# Altium project BMS.PrjPcb
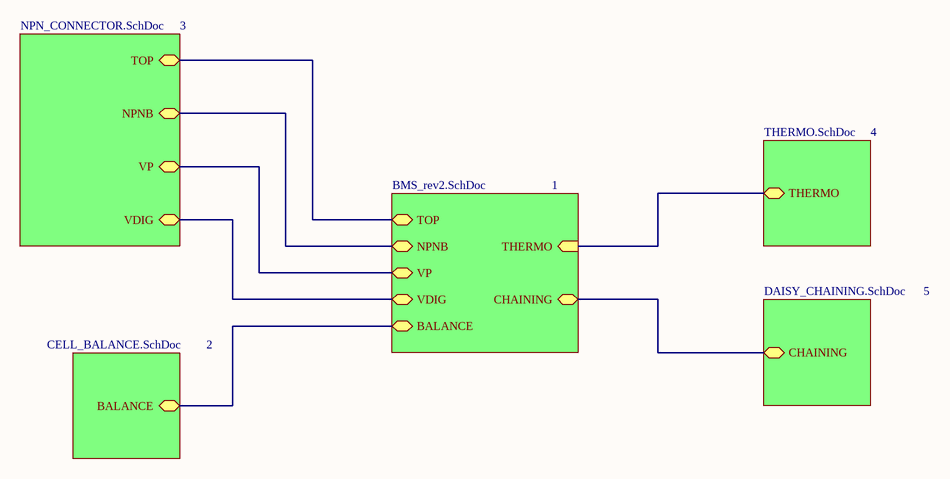
[diagram p0: BMS.SchDoc]
5 sheets, 66 parts. Net scope: hierarchical (ports join the sheet entries above them; power ports are global).
Board files: PCB_REV1.PcbDoc, PCB_REV2.PcbDoc
Sheets:
  BMS.SchDoc
    1 = BMS_rev2.SchDoc
    2 = CELL_BALANCE.SchDoc
    5 = DAISY_CHAINING.SchDoc
    4 = THERMO.SchDoc

## Sheet BMS.SchDoc
size A4

### Sub-sheets
1 = BMS_rev2.SchDoc: TOP, NPNB, VP, BALANCE, THERMO (in), CHAINING, VDIG
2 = CELL_BALANCE.SchDoc: BALANCE
3 = NPN_CONNECTOR.SchDoc (file not in this document): TOP, NPNB, VP, VDIG
4 = THERMO.SchDoc: THERMO (harness thermo)
5 = DAISY_CHAINING.SchDoc: CHAINING

### Nets
NetR67_2: sheet 1/TOP, sheet 3/TOP
NetU1_34: sheet 1/VDIG, sheet 3/VDIG
NetU1_70: sheet 1/VP, sheet 3/VP
NetU1_71: sheet 1/NPNB, sheet 3/NPNB
(unnamed): sheet 1/BALANCE, sheet 2/BALANCE
(unnamed): sheet 1/CHAINING, sheet 5/CHAINING

## Sheet BMS_rev2.SchDoc
size A4
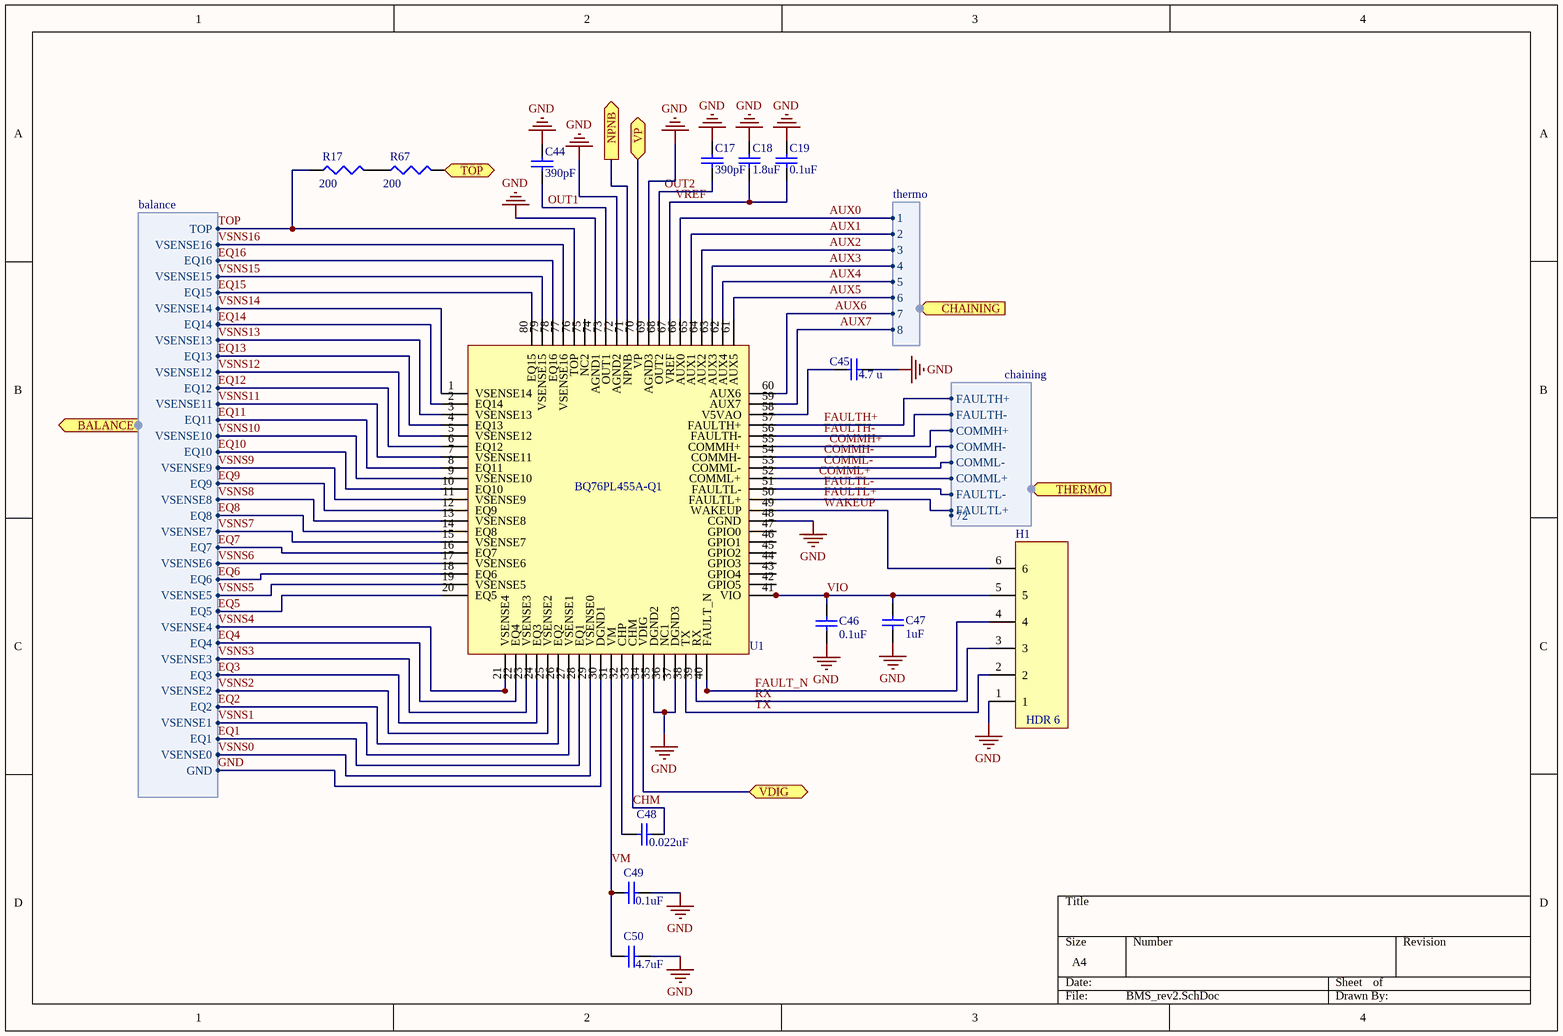
[diagram p1: BMS_rev2.SchDoc]

### Parts
C17  value 390pF  [0805 CAP]  (hidden comment: Cap Semi)
C18  value 1.8uF  [1210 cap]  (hidden comment: Cap Semi)
C19  value 0.1uF  [0603 CAP]  (hidden comment: Cap Semi)
C44  value 390pF  [0805 CAP]  (hidden comment: Cap Semi)
C45  value 4.7 u  [0805 CAP]  (hidden comment: Cap Semi)
C46  value 0.1uF  [0603 CAP]  (hidden comment: Cap Semi)
C47  value 1uF  [0603 CAP]  (hidden comment: Cap Semi)
C48  value 0.022uF  [0603 CAP]  (hidden comment: Cap Semi)
C49  value 0.1uF  [0603 CAP]  (hidden comment: Cap Semi)
C50  value 4.7uF  [0805 CAP]  (hidden comment: Cap Semi)
H1  HDR 6  [SERIAL HDR]
R17  value 200  [2512 RES]  (hidden comment: RES3)
R67  value 200  [2512 RES]  (hidden comment: RES3)
U1  BQ76PL455A-Q1  [BQ76PL455A-Q1]

### Ports
BALANCE (harness balance), CHAINING (harness thermo), NPNB, THERMO (harness chaining), TOP, VDIG, VP

### Harnesses
balance: TOP, VSENSE16, EQ16, VSENSE15, EQ15, VSENSE14, EQ14, VSENSE13, EQ13, VSENSE12, EQ12, VSENSE11, EQ11, VSENSE10, EQ10, VSENSE9, EQ9, VSENSE8, EQ8, VSENSE7, EQ7, VSENSE6, EQ6, VSENSE5, EQ5, VSENSE4, EQ4, VSENSE3, EQ3, VSENSE2, EQ2, VSENSE1, EQ1, VSENSE0, GND
chaining: FAULTH+, FAULTH-, COMMH+, COMMH-, COMML-, COMML+, FAULTL-, FAULTL+, 72
thermo: 1, 2, 3, 4, 5, 6, 7, 8

### Nets
GND: C17.1 C18.1 C19.1 C44.1 C45.2 C46.1 C47.1 C49.2 C50.2 H1.1 U1.30(DGND1) U1.35(DGND2) U1.37(DGND3) U1.48(CGND) U1.69(AGND3) U1.72(AGND2) U1.74(AGND1) ; port BALANCE.GND
AUX0: U1.66(AUX0) ; port CHAINING.1
AUX1: U1.65(AUX1) ; port CHAINING.2
AUX2: U1.64(AUX2) ; port CHAINING.3
AUX3: U1.63(AUX3) ; port CHAINING.4
AUX4: U1.62(AUX4) ; port CHAINING.5
AUX5: U1.61(AUX5) ; port CHAINING.6
AUX6: U1.60(AUX6) ; port CHAINING.7
AUX7: U1.59(AUX7) ; port CHAINING.8
CHM: C48.2 U1.33(CHM)
COMMH+: U1.55(COMMH+) ; port THERMO.COMMH+
COMMH-: U1.54(COMMH-) ; port THERMO.COMMH-
COMML+: U1.52(COMML+) ; port THERMO.COMML+
COMML-: U1.53(COMML-) ; port THERMO.COMML-
EQ1: U1.28(EQ1) ; port BALANCE.EQ1
EQ2: U1.26(EQ2) ; port BALANCE.EQ2
EQ3: U1.24(EQ3) ; port BALANCE.EQ3
EQ4: U1.22(EQ4) ; port BALANCE.EQ4
EQ5: U1.20(EQ5) ; port BALANCE.EQ5
EQ6: U1.18(EQ6) ; port BALANCE.EQ6
EQ7: U1.16(EQ7) ; port BALANCE.EQ7
EQ8: U1.14(EQ8) ; port BALANCE.EQ8
EQ9: U1.12(EQ9) ; port BALANCE.EQ9
EQ10: U1.10(EQ10) ; port BALANCE.EQ10
EQ11: U1.8(EQ11) ; port BALANCE.EQ11
EQ12: U1.6(EQ12) ; port BALANCE.EQ12
EQ13: U1.4(EQ13) ; port BALANCE.EQ13
EQ14: U1.2(EQ14) ; port BALANCE.EQ14
EQ15: U1.80(EQ15) ; port BALANCE.EQ15
EQ16: U1.78(EQ16) ; port BALANCE.EQ16
FAULT_N: H1.4 U1.40(FAULT_N)
FAULTH+: U1.57(FAULTH+) ; port THERMO.FAULTH+
FAULTH-: U1.56(FAULTH-) ; port THERMO.FAULTH-
FAULTL+: U1.50(FAULTL+) ; port THERMO.FAULTL+
FAULTL-: U1.51(FAULTL-) ; port THERMO.FAULTL-
OUT1: C44.2 U1.73(OUT1)
OUT2: C17.2 U1.68(OUT2)
RX: H1.3 U1.39(RX)
TOP: R17.1 U1.76(TOP) ; port BALANCE.TOP
TX: H1.2 U1.38(TX)
VIO: C46.2 C47.2 H1.5 U1.41(VIO)
VM: C49.1 C50.1 U1.31(VM)
VREF: C18.2 C19.2 U1.67(VREF)
VSNS0: U1.29(VSENSE0) ; port BALANCE.VSENSE0
VSNS1: U1.27(VSENSE1) ; port BALANCE.VSENSE1
VSNS2: U1.25(VSENSE2) ; port BALANCE.VSENSE2
VSNS3: U1.23(VSENSE3) ; port BALANCE.VSENSE3
VSNS4: U1.21(VSENSE4) ; port BALANCE.VSENSE4
VSNS5: U1.19(VSENSE5) ; port BALANCE.VSENSE5
VSNS6: U1.17(VSENSE6) ; port BALANCE.VSENSE6
VSNS7: U1.15(VSENSE7) ; port BALANCE.VSENSE7
VSNS8: U1.13(VSENSE8) ; port BALANCE.VSENSE8
VSNS9: U1.11(VSENSE9) ; port BALANCE.VSENSE9
VSNS10: U1.9(VSENSE10) ; port BALANCE.VSENSE10
VSNS11: U1.7(VSENSE11) ; port BALANCE.VSENSE11
VSNS12: U1.5(VSENSE12) ; port BALANCE.VSENSE12
VSNS13: U1.3(VSENSE13) ; port BALANCE.VSENSE13
VSNS14: U1.1(VSENSE14) ; port BALANCE.VSENSE14
VSNS15: U1.79(VSENSE15) ; port BALANCE.VSENSE15
VSNS16: U1.77(VSENSE16) ; port BALANCE.VSENSE16
WAKEUP: H1.6 U1.49(WAKEUP)
NetC45_1: C45.1 U1.58(V5VAO)
NetC48_1: C48.1 U1.32(CHP)
NetR17_2: R17.2 R67.1
NetR67_2: R67.2 ; port TOP
NetU1_34: U1.34(VDIG) ; port VDIG
NetU1_70: U1.70(VP) ; port VP
NetU1_71: U1.71(NPNB) ; port NPNB

Not connected (* = marked no-connect by the designer): U1 36(NC1) 42(GPIO5) 43(GPIO4) 44(GPIO3) 45(GPIO2) 46(GPIO1) 47(GPIO0) 75(NC2)

### Library data of the parts
C17 C44 = Cap Semi: Capacitor (Semiconductor SIM Model); Manufacturer: Kyocera AVX; Manufacturer Part Number: 08055A391JAT2A; Description: CAP CER 390PF 50V NP0 0805; Dielectric Material: Ceramic; Voltage Rating: 50V; Tolerance: 5%; Dielectric: C0G; Temperature Coefficient: 30ppm/°C; Published: 8-Jun-2000; LatestRevisionDate: 29-May-2009; LatestRevisionNote: IPC-7351 Footprint Added.; PackageReference: C1206; Publisher: Altium Limited; PackageDescription: Chip Capacitor; Supplier 1: Digi-Key; Supplier Part Number 1: 478-1323-1-ND; Stock 1: 18; Pricing 1: 1=0.22, 10=0.16, 100=0.075, 500=0.0526, 1000=0.0436 (USD); Mount: PCB,Surface Mount; Case/Package: 0805; Number of Pins: 2; Case Code (Imperial): 0805; Case Code (Metric): 2012; Contact Plating: Matte,Tin; Min Operating Temperature: -55°C; Max Operating Temperature: 125°C; Packaging: Tape and Reel; Capacitance: 390pF; Package Quantity: 1; Voltage Rating (DC): 50V; Termination: SMD/SMT; Voltage: 50V; Length: 2.01mm; Height: 0.94mm; Width: 1.25mm; Thickness: 0.037inch; Depth: 1.25mm; Radiation Hardening: No; REACH SVHC: No SVHC; Lead Free: Lead Free
C18 = Cap Semi: Capacitor (Semiconductor SIM Model); Manufacturer: KEMET; Manufacturer Part Number: C1210C185K3RACTU; Description: CAP CER 1.8UF 25V X7R 1210; Dielectric Material: Ceramic; Voltage Rating: 25V; Tolerance: 10%; Dielectric: X7R; Dissipation Factor: 3.5%; Published: 8-Jun-2000; LatestRevisionDate: 29-May-2009; LatestRevisionNote: IPC-7351 Footprint Added.; PackageReference: C1206; Publisher: Altium Limited; PackageDescription: Chip Capacitor; Supplier 1: Digi-Key; Supplier Part Number 1: 399-3082-1-ND; Stock 1: 3925; Pricing 1: 1=1.15, 10=0.876, 100=0.6267, 500=0.4852, 1000=0.4178 (USD); Mount: PCB,Surface Mount; Case/Package: 1210; Case Code (Metric): 3225; Case Code (Imperial): 1210; Min Operating Temperature: -55°C; Max Operating Temperature: 125°C; Package Quantity: 1; Capacitance: 1.8uF; Packaging: Tape and Reel; Voltage Rating (DC): 25V; Termination: SMD/SMT; Voltage: 25V; Length: 3.2mm; Height: 1.55mm; Width: 0.098inch; Thickness: 0.067inch; Depth: 2.5mm; REACH SVHC: No SVHC
C19 C46 C49 = Cap Semi: Capacitor (Semiconductor SIM Model); Manufacturer: KEMET; Manufacturer Part Number: C0603X104K3RACTU; Description: CAP CER 0.1UF 25V X7R 0603; Dielectric Material: Ceramic; Tolerance: 10%; Capacitance: 100nF; Voltage Rating: 25V; Dielectric: X7R; Dissipation Factor: 3.5%; Published: 8-Jun-2000; LatestRevisionDate: 29-May-2009; LatestRevisionNote: IPC-7351 Footprint Added.; PackageReference: C1206; Publisher: Altium Limited; PackageDescription: Chip Capacitor; Supplier 1: Digi-Key; Supplier Part Number 1: 399-5345-1-ND; Stock 1: 0; Pricing 1: 1=0.34, 10=0.237, 100=0.1423, 500=0.1067, 1000=0.0901 (USD); Mount: PCB,Surface Mount; Case/Package: 0603; Number of Pins: 2; Case Code (Imperial): 0603; Case Code (Metric): 1608; Contact Plating: Matte,Tin; Min Operating Temperature: -55°C; Max Operating Temperature: 125°C; Packaging: Tape and Reel; Package Quantity: 1; Voltage Rating (DC): 25V; Termination: SMD/SMT; Voltage: 25V; Features: Soft Termination; Length: 1.6mm; Height: 0.8mm; Width: 0.8mm; Thickness: 0.034inch; Depth: 0.8mm; Radiation Hardening: No; REACH SVHC: No SVHC
C45 = Cap Semi: Capacitor (Semiconductor SIM Model); Manufacturer: Murata; Manufacturer Part Number: GRM21BR71C475KA73L; Description: CAP CER 4.7UF 16V X7R 0805; Material: Ceramic; Capacitance: 4.7uF; Tolerance: 10%; Voltage Rating: 16V; Dielectric: X7R; Published: 8-Jun-2000; LatestRevisionDate: 29-May-2009; LatestRevisionNote: IPC-7351 Footprint Added.; PackageReference: C1206; Publisher: Altium Limited; PackageDescription: Chip Capacitor; Supplier 1: Digi-Key; Supplier Part Number 1: 490-4522-2-ND; Stock 1: 0; Pricing 1: 3000=0.1698 (USD); Mount: Surface Mount; Case/Package: 0805; Number of Pins: 2; Case Code (Metric): 2012; Case Code (Imperial): 0805; Min Operating Temperature: -55°C; Max Operating Temperature: 125°C; Packaging: Tape and Reel; Package Quantity: 1; Voltage Rating (DC): 16V; Termination: SMD/SMT; Voltage: 16V; Length: 2mm; Height: 1.25mm; Width: 0.049inch; Thickness: 0.053inch; Depth: 1.25mm; REACH SVHC: No SVHC; Lead Free: Lead Free
C47 = Cap Semi: Capacitor (Semiconductor SIM Model); Manufacturer: TDK; Manufacturer Part Number: C1608X7R1C105K080AC; Description: TDK   C1608X7R1C105K080AC   CAPACITOR CERAMIC, 1UF, 16V, X7R, 10%, 0603; Dielectric Material: Ceramic; Tolerance: 10%; Voltage Rating: 16V; Dielectric: X7R; Published: 8-Jun-2000; LatestRevisionDate: 29-May-2009; LatestRevisionNote: IPC-7351 Footprint Added.; PackageReference: C1206; Publisher: Altium Limited; PackageDescription: Chip Capacitor; Supplier 1: Digi-Key; Supplier Part Number 1: 445-1604-1-ND; Stock 1: 135; Pricing 1: 1=0.12, 10=0.087, 100=0.0387, 500=0.0277, 1000=0.0217 (USD); Mount: Surface Mount; Case/Package: 0603; Weight: 7.1E-05oz; Case Code (Metric): 1608; Case Code (Imperial): 0603; Min Operating Temperature: -55°C; Max Operating Temperature: 125°C; Packaging: Tape and Reel; Package Quantity: 1; Termination: SMD/SMT; Capacitance: 1uF; Voltage Rating (DC): 16V; Composition: Ceramic; Voltage: 16V; Length: 1.6mm; Height: 0.8mm; Width: 0.031inch; Thickness: 0.037inch; Depth: 0.8mm; Radiation Hardening: No; REACH SVHC: No SVHC; Lead Free: Lead Free
C48 = Cap Semi: Capacitor (Semiconductor SIM Model); Manufacturer: TDK; Manufacturer Part Number: C1608X7R1H223K080AA; Description: CAP CER 0.022UF 50V X7R 0603; Dielectric Material: Ceramic; Capacitance: 22nF; Tolerance: 10%; Voltage Rating: 50V; Dielectric: X7R; Published: 8-Jun-2000; LatestRevisionDate: 29-May-2009; LatestRevisionNote: IPC-7351 Footprint Added.; PackageReference: C1206; Publisher: Altium Limited; PackageDescription: Chip Capacitor; Supplier 1: Digi-Key; Supplier Part Number 1: 445-1312-1-ND; Stock 1: 0; Pricing 1: 1=0.1, 10=0.074, 100=0.0331, 500=0.0237, 1000=0.0186 (USD); Mount: Surface Mount; Case/Package: 0603; Number of Pins: 2; Weight: 7.1E-05oz; Case Code (Metric): 1608; Case Code (Imperial): 0603; Min Operating Temperature: -55°C; Max Operating Temperature: 125°C; Package Quantity: 1; Packaging: Tape and Reel; Voltage Rating (DC): 50V; Termination: SMD/SMT; Composition: Ceramic; Voltage: 50V; Length: 1.6mm; Height: 0.8mm; Width: 0.031inch; Thickness: 0.037inch; Depth: 0.8mm; Radiation Hardening: No; REACH SVHC: No SVHC; Lead Free: Lead Free
C50 = Cap Semi: Capacitor (Semiconductor SIM Model); Manufacturer: Murata; Manufacturer Part Number: GRM21BR71C475KA73L; Description: CAP CER 4.7UF 16V X7R 0805; Material: Ceramic; Tolerance: 10%; Voltage Rating: 16V; Dielectric: X7R; Published: 8-Jun-2000; LatestRevisionDate: 29-May-2009; LatestRevisionNote: IPC-7351 Footprint Added.; PackageReference: C1206; Publisher: Altium Limited; PackageDescription: Chip Capacitor; Supplier 1: Digi-Key; Supplier Part Number 1: 490-4522-2-ND; Stock 1: 0; Pricing 1: 3000=0.1698 (USD); Mount: Surface Mount; Case/Package: 0805; Number of Pins: 2; Case Code (Metric): 2012; Case Code (Imperial): 0805; Min Operating Temperature: -55°C; Max Operating Temperature: 125°C; Capacitance: 4.7uF; Packaging: Tape and Reel; Package Quantity: 1; Voltage Rating (DC): 16V; Termination: SMD/SMT; Voltage: 16V; Length: 2mm; Height: 1.25mm; Width: 0.049inch; Thickness: 0.053inch; Depth: 1.25mm; REACH SVHC: No SVHC; Lead Free: Lead Free
H1 = HDR 6: Manufacturer: Molex; Manufacturer Part Number: 0022124062; Contact Resistance: 10mR; Number of Positions: 6; Gender: Male; Connector Type: Male Pin; Pitch: 2.54mm; Supplier 1: Digi-Key; Supplier Part Number 1: WM13446-ND; Stock 1: 3075; Pricing 1: 1=1.06, 10=0.934, 100=0.8059, 500=0.6593, 1000=0.5861, 5000=0.5128, 10000=0.4872 (USD); Mount: Through Hole; Contact Plating: Gold; Contact Material: Brass; Colour: Natural; Housing Material: Nylon; Housing Colour: Natural; Min Operating Temperature: 0°C; Max Operating Temperature: 75°C; Package Quantity: 1000; Number of Rows: 1; Packaging: Bulk; Termination: Solder; Number of Contacts: 6; Orientation: Right Angle; Fastening Type: Friction; Length: 15.24mm; Contact Mating Length: 0.264inch; Depth: 14.42mm
R17 R67 = RES3: Resistor; Manufacturer: Vishay Dale; Manufacturer Part Number: CRCW2512200RJNEG; Description: RES SMD 200 OHM 5% 1W 2512; Resistance: 200R; Tolerance: 5%; Power Rating: 1W; Voltage Rating: 500V; Temperature Coefficient: 200ppm/°C; Published: 8-Jun-2000; LatestRevisionDate: 29-May-2009; LatestRevisionNote: IPC-7351 Footprint Added.; PackageReference: J1-0603; Publisher: Altium Limited; PackageDescription: Chip Resistor; Supplier 1: Digi-Key; Supplier Part Number 1: 541-200XCT-ND; Stock 1: 1091; Pricing 1: 1=0.39, 10=0.333, 100=0.1301, 1000=0.0545 (USD); Mount: Surface Mount; Case/Package: 2512; Number of Pins: 2; Weight: 0.001429oz; Case Code (Metric): 6432; Case Code (Imperial): 2512; Contact Plating: Tin; Min Operating Temperature: -55°C; Max Operating Temperature: 155°C; Packaging: Tape and Reel; Package Quantity: 2000; Composition: Thick Film; Number of Terminations: 2; Termination: SMD/SMT; Military Standard: Not; Max Power Dissipation: 1W; Voltage Rating (DC): 500V; Working Voltage: 500V; Features: Automotive AEC-Q200; Length: 6.3mm; Height: 0.6mm; Width: 0.124inch; Depth: 3.15mm; Radiation Hardening: No; REACH SVHC: Unknown; Lead Free: Lead Free
U1 = BQ76PL455A-Q1: Manufacturer: Texas Instruments; Manufacturer Part Number: BQ76PL455ATPFCRQ1; Interface: UART; Fault Protection: Over/Under Voltage; Operating Supply Voltage: 22V; Supplier 1: Digi-Key; Stock 1: 0; Pricing 1: 1=19.03, 10=17.486, 100=14.7676, 500=13.1368 (USD); Mount: Surface Mount; Case/Package: TQFP; Number of Pins: 80; Min Operating Temperature: -40°C; Max Operating Temperature: 105°C; Packaging: Tape and Reel; Lead Free: Lead Free; Supplier Part Number 1: 296-44049-1-ND

## Sheet CELL_BALANCE.SchDoc
size A4
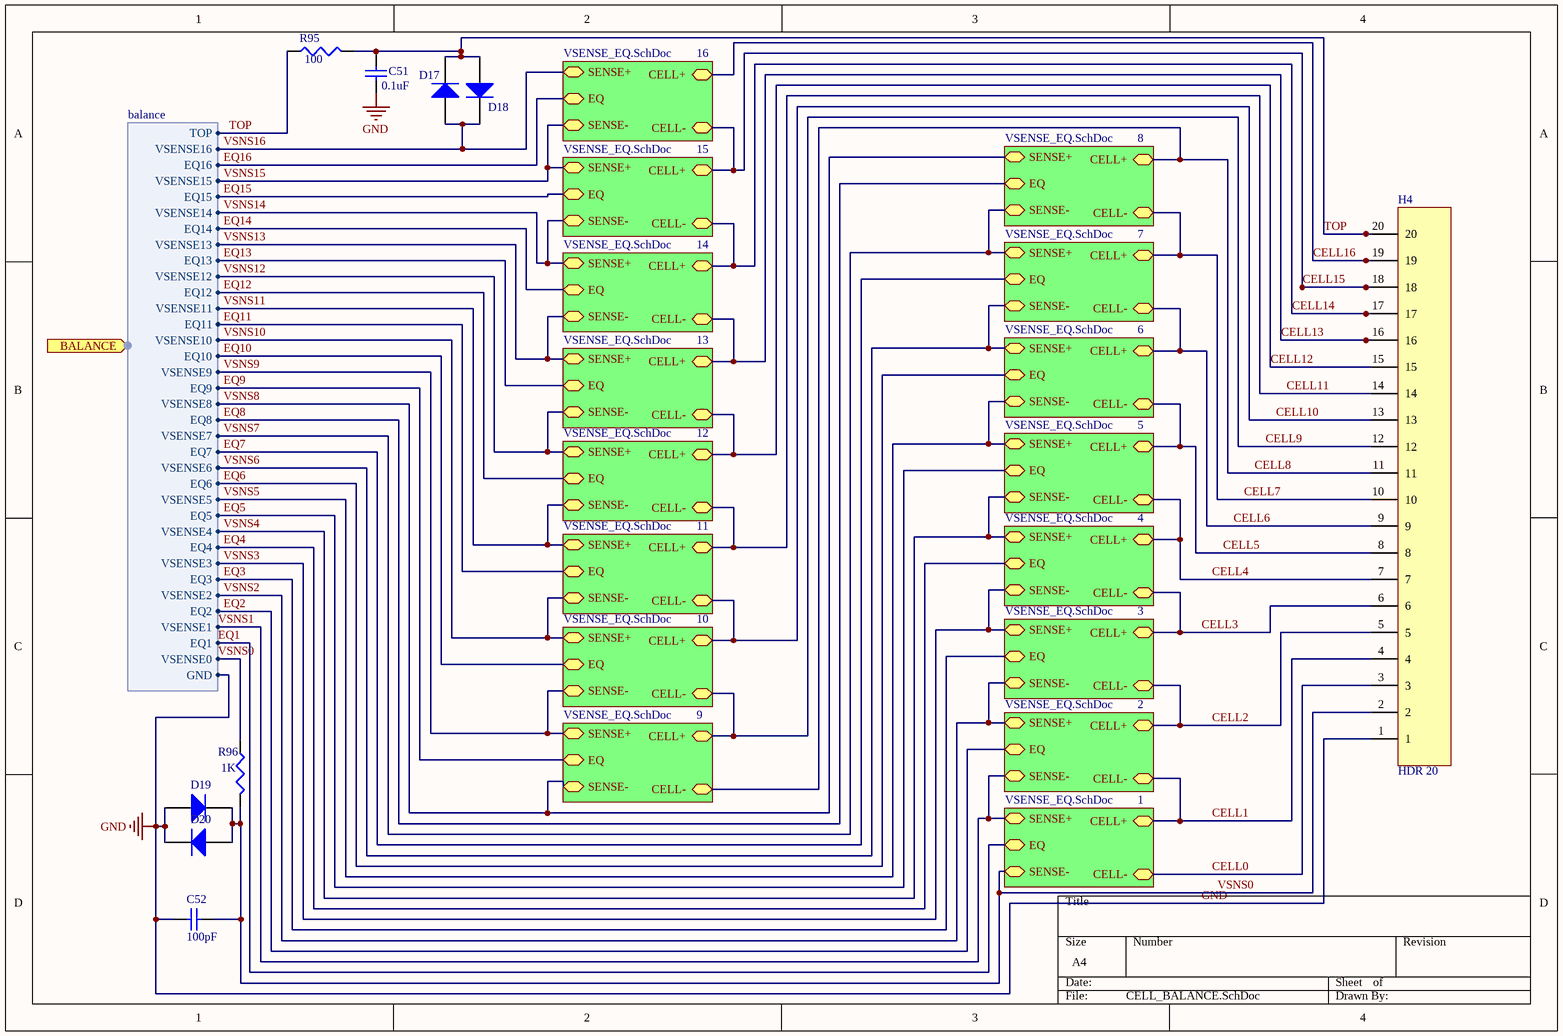
[diagram p2: CELL_BALANCE.SchDoc]

### Parts
C51  value 0.1uF  [1210 cap]  (hidden comment: Cap Semi)
C52  value 100pF  [0603 CAP]  (hidden comment: Cap Semi)
D17  (no value)  [DIODE BtoB]
D18  (no value)  [DIODE BtoB]
D19  (no value)  [DIODE BtoB]
D20  (no value)  [DIODE BtoB]
H4  HDR 20  [CELL HDR]
R95  value 100  [1206 RES]  (hidden comment: Res3)
R96  value 1K  [0603 RES]  (hidden comment: Res3)

### Sub-sheets
1 = VSENSE_EQ.SchDoc (file not in this document): SENSE+, CELL+, SENSE-, CELL-, EQ
2 = VSENSE_EQ.SchDoc (file not in this document): SENSE+, CELL+, SENSE-, CELL-, EQ
3 = VSENSE_EQ.SchDoc (file not in this document): SENSE+, CELL+, SENSE-, CELL-, EQ
4 = VSENSE_EQ.SchDoc (file not in this document): SENSE+, CELL+, SENSE-, CELL-, EQ
5 = VSENSE_EQ.SchDoc (file not in this document): SENSE+, CELL+, SENSE-, CELL-, EQ
6 = VSENSE_EQ.SchDoc (file not in this document): SENSE+, CELL+, SENSE-, CELL-, EQ
7 = VSENSE_EQ.SchDoc (file not in this document): SENSE+, CELL+, SENSE-, CELL-, EQ
8 = VSENSE_EQ.SchDoc (file not in this document): SENSE+, CELL+, SENSE-, CELL-, EQ
9 = VSENSE_EQ.SchDoc (file not in this document): SENSE+, CELL+, SENSE-, CELL-, EQ
10 = VSENSE_EQ.SchDoc (file not in this document): SENSE+, CELL+, SENSE-, CELL-, EQ
11 = VSENSE_EQ.SchDoc (file not in this document): SENSE+, CELL+, SENSE-, CELL-, EQ
12 = VSENSE_EQ.SchDoc (file not in this document): SENSE+, CELL+, SENSE-, CELL-, EQ
13 = VSENSE_EQ.SchDoc (file not in this document): SENSE+, CELL+, SENSE-, CELL-, EQ
14 = VSENSE_EQ.SchDoc (file not in this document): SENSE+, CELL+, SENSE-, CELL-, EQ
15 = VSENSE_EQ.SchDoc (file not in this document): SENSE+, CELL+, SENSE-, CELL-, EQ
16 = VSENSE_EQ.SchDoc (file not in this document): SENSE+, CELL+, SENSE-, CELL-, EQ

### Ports
BALANCE (harness balance)

### Harnesses
balance: GND, VSENSE0, EQ1, VSENSE1, EQ2, VSENSE2, EQ3, VSENSE3, EQ4, VSENSE4, EQ5, VSENSE5, EQ6, VSENSE6, EQ7, VSENSE7, EQ8, VSENSE8, EQ9, VSENSE9, EQ10, VSENSE10, EQ11, VSENSE11, EQ12, VSENSE12, EQ13, VSENSE13, EQ14, VSENSE14, EQ15, VSENSE15, EQ16, VSENSE16, TOP

### Nets
GND: C51.1 C52.1 D19.1(A) D20.2(K) H4.1 ; port BALANCE.GND
CELL0: H4.3 ; sheet 1/CELL-
CELL1: H4.4 ; sheet 2/CELL-, sheet 1/CELL+
CELL2: H4.5 ; sheet 3/CELL-, sheet 2/CELL+
CELL3: H4.6 ; sheet 4/CELL-, sheet 3/CELL+
CELL4: H4.7 ; sheet 4/CELL+, sheet 5/CELL-
CELL5: H4.8 ; sheet 5/CELL+, sheet 6/CELL-
CELL6: H4.9 ; sheet 6/CELL+, sheet 7/CELL-
CELL7: H4.10 ; sheet 7/CELL+, sheet 8/CELL-
CELL8: H4.11 ; sheet 8/CELL+, sheet 9/CELL-
CELL9: H4.12 ; sheet 10/CELL-, sheet 9/CELL+
CELL10: H4.13 ; sheet 11/CELL-, sheet 10/CELL+
CELL11: H4.14 ; sheet 12/CELL-, sheet 11/CELL+
CELL12: H4.15 ; sheet 12/CELL+, sheet 13/CELL-
CELL13: H4.16 ; sheet 13/CELL+, sheet 14/CELL-
CELL14: H4.17 ; sheet 14/CELL+, sheet 15/CELL-
CELL15: H4.18 ; sheet 15/CELL+, sheet 16/CELL-
CELL16: H4.19 ; sheet 16/CELL+
EQ1: sheet 1/EQ, port BALANCE.EQ1
EQ2: sheet 2/EQ, port BALANCE.EQ2
EQ3: sheet 3/EQ, port BALANCE.EQ3
EQ4: sheet 4/EQ, port BALANCE.EQ4
EQ5: sheet 5/EQ, port BALANCE.EQ5
EQ6: sheet 6/EQ, port BALANCE.EQ6
EQ7: sheet 7/EQ, port BALANCE.EQ7
EQ8: sheet 8/EQ, port BALANCE.EQ8
EQ9: sheet 9/EQ, port BALANCE.EQ9
EQ10: sheet 10/EQ, port BALANCE.EQ10
EQ11: sheet 11/EQ, port BALANCE.EQ11
EQ12: sheet 12/EQ, port BALANCE.EQ12
EQ13: sheet 13/EQ, port BALANCE.EQ13
EQ14: sheet 14/EQ, port BALANCE.EQ14
EQ15: sheet 15/EQ, port BALANCE.EQ15
EQ16: sheet 16/EQ, port BALANCE.EQ16
TOP: C51.2 D17.2(K) D18.1(A) H4.20 R95.1 R95.2 ; port BALANCE.TOP
VSNS0: C52.2 D19.2(K) D20.1(A) H4.2 R96.1 R96.2 ; sheet 1/SENSE-, port BALANCE.VSENSE0
VSNS1: sheet 2/SENSE-, sheet 1/SENSE+, port BALANCE.VSENSE1
VSNS2: sheet 3/SENSE-, sheet 2/SENSE+, port BALANCE.VSENSE2
VSNS3: sheet 4/SENSE-, sheet 3/SENSE+, port BALANCE.VSENSE3
VSNS4: sheet 4/SENSE+, sheet 5/SENSE-, port BALANCE.VSENSE4
VSNS5: sheet 5/SENSE+, sheet 6/SENSE-, port BALANCE.VSENSE5
VSNS6: sheet 6/SENSE+, sheet 7/SENSE-, port BALANCE.VSENSE6
VSNS7: sheet 7/SENSE+, sheet 8/SENSE-, port BALANCE.VSENSE7
VSNS8: sheet 8/SENSE+, sheet 9/SENSE-, port BALANCE.VSENSE8
VSNS9: sheet 10/SENSE-, sheet 9/SENSE+, port BALANCE.VSENSE9
VSNS10: sheet 11/SENSE-, sheet 10/SENSE+, port BALANCE.VSENSE10
VSNS11: sheet 12/SENSE-, sheet 11/SENSE+, port BALANCE.VSENSE11
VSNS12: sheet 12/SENSE+, sheet 13/SENSE-, port BALANCE.VSENSE12
VSNS13: sheet 13/SENSE+, sheet 14/SENSE-, port BALANCE.VSENSE13
VSNS14: sheet 14/SENSE+, sheet 15/SENSE-, port BALANCE.VSENSE14
VSNS15: sheet 15/SENSE+, sheet 16/SENSE-, port BALANCE.VSENSE15
VSNS16: D17.1(A) D18.2(K) ; sheet 16/SENSE+, port BALANCE.VSENSE16

### Library data of the parts
C51 = Cap Semi: Capacitor (Semiconductor SIM Model); Manufacturer: Murata; Manufacturer Part Number: GRM32NR72A104KA01L; Description: CAP CER 0.1UF 100V X7R 1210; Material: Ceramic; Capacitance: 100nF; Tolerance: 10%; Voltage Rating: 100V; Dielectric: X7R; Dissipation Factor: 0.05%; Published: 8-Jun-2000; LatestRevisionDate: 29-May-2009; LatestRevisionNote: IPC-7351 Footprint Added.; PackageReference: C1206; Publisher: Altium Limited; PackageDescription: Chip Capacitor; Supplier 1: Digi-Key; Supplier Part Number 1: 490-1853-1-ND; Stock 1: 0; Pricing 1: 1=0.86, 10=0.608, 100=0.4002, 500=0.2964, 1000=0.252 (USD); Mount: Surface Mount; Case/Package: 1210; Weight: 0.00388oz; Case Code (Metric): 3225; Case Code (Imperial): 1210; Dielectric Material: Ceramic; Min Operating Temperature: -55°C; Max Operating Temperature: 125°C; Package Quantity: 1; Packaging: Tape and Reel; Voltage Rating (DC): 100V; Termination: SMD/SMT; Voltage: 100V; Length: 3.2mm; Height: 1.35mm; Width: 2.5mm; Thickness: 0.059inch; Depth: 2.5mm; Radiation Hardening: No; Lead Free: Lead Free
C52 = Cap Semi: Capacitor (Semiconductor SIM Model); Manufacturer: TDK; Manufacturer Part Number: C1608X7R1C105K080AC; Description: TDK   C1608X7R1C105K080AC   CAPACITOR CERAMIC, 1UF, 16V, X7R, 10%, 0603; Dielectric Material: Ceramic; Tolerance: 10%; Capacitance: 1uF; Voltage Rating: 16V; Dielectric: X7R; Published: 8-Jun-2000; LatestRevisionDate: 29-May-2009; LatestRevisionNote: IPC-7351 Footprint Added.; PackageReference: C1206; Publisher: Altium Limited; PackageDescription: Chip Capacitor; Supplier 1: Digi-Key; Supplier Part Number 1: 445-1604-6-ND; Stock 1: 8000; Pricing 1: 1=0.12, 10=0.087, 100=0.0387, 500=0.0277, 1000=0.0217 (USD); Mount: Surface Mount; Case/Package: 0603; Weight: 7.1E-05oz; Case Code (Metric): 1608; Case Code (Imperial): 0603; Min Operating Temperature: -55°C; Max Operating Temperature: 125°C; Packaging: Tape and Reel; Package Quantity: 1; Termination: SMD/SMT; Voltage Rating (DC): 16V; Composition: Ceramic; Voltage: 16V; Length: 1.6mm; Height: 0.8mm; Width: 0.031inch; Thickness: 0.037inch; Depth: 0.8mm; Radiation Hardening: No; REACH SVHC: No SVHC; Lead Free: Lead Free
D17-D20 = Diode: Default Diode; Manufacturer: Diodes; Manufacturer Part Number: 1N4148W-7-F; Description: DIODE GEN PURP 100V 300MA SOD123; Max Surge Current: 2A; Forward Current: 150mA; Peak Reverse Current: 1uA; Recovery Time: 4ns; Forward Voltage: 1.25V; Average Rectified Current: 300mA; Max Repetitive Reverse Voltage (Vrrm): 100V; Power Dissipation: 400mW; Element Configuration: Single; Polarity: Standard; Voltage Rating (DC): 75V; Capacitance: 2pF; Current: 15A; Published: 8-Jun-2000; LatestRevisionDate: 17-Jul-2002; LatestRevisionNote: Re-released for DXP Platform.; PackageVersion: Sep-1996; PackageReference: SMC; Publisher: Altium Limited; PackageDescription: DO-214-AB/SMC; 2 C-Bend Leads; Body 7.9 x 5.9 mm, inc. leads (LxW); Code_JEDEC: DO-214-AB; Supplier 1: Digi-Key; Supplier Part Number 1: 1N4148W-FDICT-ND; Stock 1: 0; Pricing 1: 1=0.18, 10=0.164, 100=0.0891, 500=0.0548, 1000=0.0374 (USD); Mount: Surface Mount; Number of Pins: 2; Weight: 0.000353oz; Contact Plating: Matte,Tin; Min Operating Temperature: -65°C; Max Operating Temperature: 150°C; Package Quantity: 3000; Packaging: Tape and Reel; Reverse Recovery Time: 4ns; Peak Non-Repetitive Surge Current: 2A; Power Rating: 400mW; Max Reverse Voltage (DC): 100V; Max Forward Surge Current (Ifsm): 2A; Current Rating: 150mA; Output Current: 150mA; Voltage: 100V; Length: 2.85mm; Height: 1.25mm; Width: 1.7mm; Radiation Hardening: No; Lead Free: Lead Free; REACH SVHC: No SVHC
R95 = Res3: Resistor; Manufacturer: Vishay Dale; Manufacturer Part Number: CRCW1206100RFKEA; Description: Res Thick Film 1206 100 Ohm 1% 0.25W(1/4W) ±100ppm/C SMD Automotive Paper T/R; Resistance: 100R; Tolerance: 1%; Power Rating: 250mW; Voltage Rating: 200V; Temperature Coefficient: 100ppm/°C; Published: 8-Jun-2000; LatestRevisionDate: 29-May-2009; LatestRevisionNote: IPC-7351 Footprint Added.; PackageReference: J1-0603; Publisher: Altium Limited; PackageDescription: Chip Resistor; Supplier 1: Digi-Key; Supplier Part Number 1: 541-100FCT-ND; Stock 1: 0; Pricing 1: 1=0.1, 10=0.075, 100=0.0304, 1000=0.0136, 2500=0.0118 (USD); Mount: Surface Mount; Case/Package: 1206; Number of Pins: 2; Weight: 0.000353oz; Case Code (Imperial): 1206; Case Code (Metric): 3216; Contact Plating: Tin; Min Operating Temperature: -55°C; Max Operating Temperature: 155°C; Packaging: Tape and Reel; Package Quantity: 5000; Composition: Thick Film; Termination: SMD/SMT; Military Standard: Not; Voltage Rating (DC): 200V; Length: 3.2mm; Height: 0.55mm; Width: 1.6mm; Depth: 1.6mm; Radiation Hardening: No; REACH SVHC: Unknown; Lead Free: Lead Free
R96 = Res3: Resistor; Manufacturer: Vishay Dale; Manufacturer Part Number: CRCW06031K00FKEA; Description: RES SMD 1K OHM 1% 1/10W 0603; Resistance: 1kR; Power Rating: 100mW; Tolerance: 1%; Voltage Rating: 75V; Temperature Coefficient: 100ppm/°C; Published: 8-Jun-2000; LatestRevisionDate: 29-May-2009; LatestRevisionNote: IPC-7351 Footprint Added.; PackageReference: J1-0603; Publisher: Altium Limited; PackageDescription: Chip Resistor; Supplier 1: Digi-Key; Supplier Part Number 1: 541-1.00KHCT-ND; Stock 1: 0; Pricing 1: 1=0.1, 10=0.042, 100=0.017, 1000=0.0076, 2500=0.0066 (USD); Mount: Surface Mount; Case/Package: 0603; Number of Pins: 2; Weight: 7.1E-05oz; Case Code (Metric): 1608; Case Code (Imperial): 0603; Contact Plating: Tin; Min Operating Temperature: -55°C; Max Operating Temperature: 155°C; Composition: Thick Film; Packaging: Tape and Reel; Package Quantity: 10; Number of Terminations: 2; Termination: SMD/SMT; Military Standard: Not; Max Power Dissipation: 100mW; Voltage Rating (DC): 75V; Features: Automotive AEC-Q200; Length: 1.55mm; Height: 0.45mm; Width: 0.033inch; Depth: 0.85mm; Radiation Hardening: No; REACH SVHC: Unknown; Lead Free: Lead Free

## Sheet DAISY_CHAINING.SchDoc
size A4
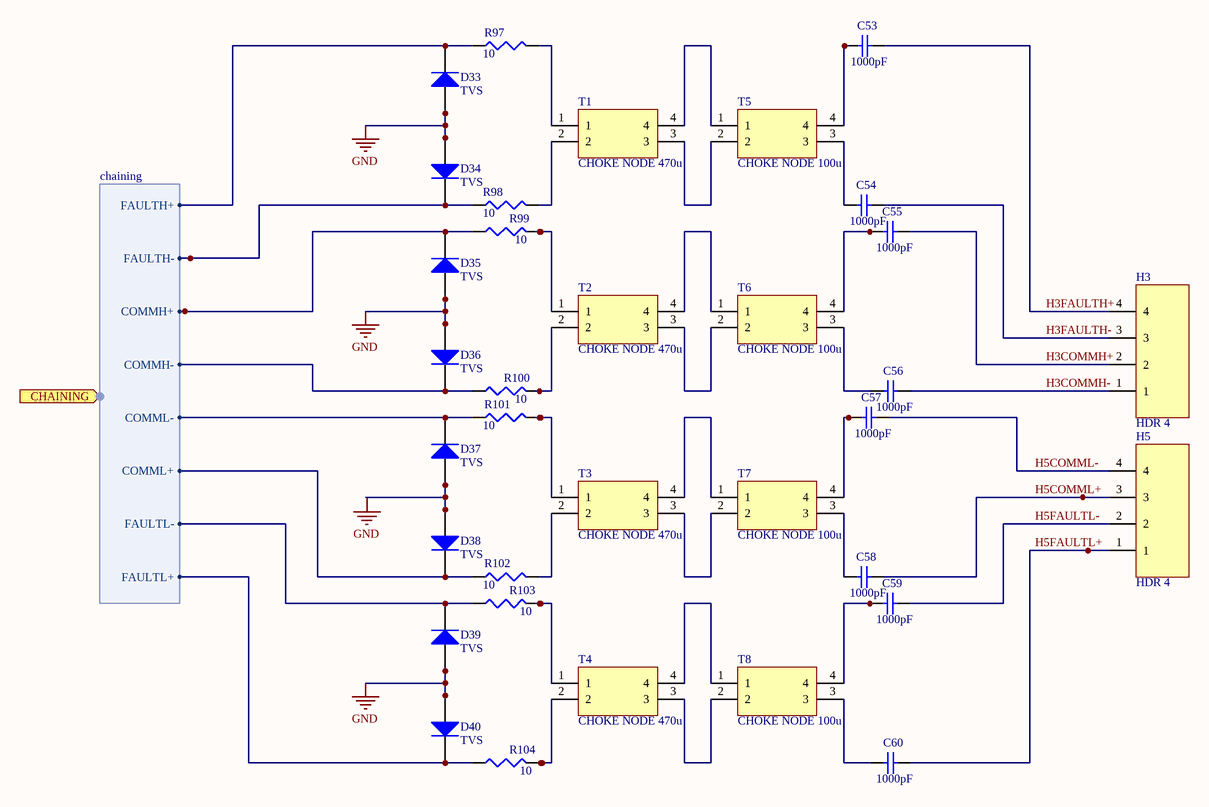
[diagram p3: DAISY_CHAINING.SchDoc]

### Parts
C53  value 1000pF  [1206 CAP]  (hidden comment: Cap Semi)
C54  value 1000pF  [1206 CAP]  (hidden comment: Cap Semi)
C55  value 1000pF  [1206 CAP]  (hidden comment: Cap Semi)
C56  value 1000pF  [1206 CAP]  (hidden comment: Cap Semi)
C57  value 1000pF  [1206 CAP]  (hidden comment: Cap Semi)
C58  value 1000pF  [1206 CAP]  (hidden comment: Cap Semi)
C59  value 1000pF  [1206 CAP]  (hidden comment: Cap Semi)
C60  value 1000pF  [1206 CAP]  (hidden comment: Cap Semi)
D33  TVS  [TVS DIODE]
D34  TVS  [TVS DIODE]
D35  TVS  [TVS DIODE]
D36  TVS  [TVS DIODE]
D37  TVS  [TVS DIODE]
D38  TVS  [TVS DIODE]
D39  TVS  [TVS DIODE]
D40  TVS  [TVS DIODE]
H3  HDR 4  [COMM HDR]
H5  HDR 4  [COMM HDR]
R97  value 10  [1206 RES]  (hidden comment: Res3)
R98  value 10  [1206 RES]  (hidden comment: Res3)
R99  value 10  [1206 RES]  (hidden comment: Res3)
R100  value 10  [1206 RES]  (hidden comment: Res3)
R101  value 10  [1206 RES]  (hidden comment: Res3)
R102  value 10  [1206 RES]  (hidden comment: Res3)
R103  value 10  [1206 RES]  (hidden comment: Res3)
R104  value 10  [1206 RES]  (hidden comment: Res3)
T1  CHOKE NODE 470u  [CHOKE NODE 470u]
T2  CHOKE NODE 470u  [CHOKE NODE 470u]
T3  CHOKE NODE 470u  [CHOKE NODE 470u]
T4  CHOKE NODE 470u  [CHOKE NODE 470u]
T5  CHOKE NODE 100u  [CHOKE NODE 100u]
T6  CHOKE NODE 100u  [CHOKE NODE 100u]
T7  CHOKE NODE 100u  [CHOKE NODE 100u]
T8  CHOKE NODE 100u  [CHOKE NODE 100u]

### Ports
CHAINING (harness chaining)

### Harnesses
chaining: FAULTH+, FAULTH-, COMMH+, COMMH-, COMML+, COMML-, FAULTL-, FAULTL+

### Nets
GND: D33.1(A) D34.1(A) D35.1(A) D36.1(A) D39.1(A) D40.1(A)
H3COMMH+: C55.2 H3.2
H3COMMH-: C56.2 H3.1
H3FAULTH+: C53.2 H3.4
H3FAULTH-: C54.2 H3.3
H5COMML+: C58.2 H5.3
H5COMML-: C57.2 H5.4
H5FAULTL+: C60.2 H5.1
H5FAULTL-: C59.2 H5.2
NetC53_1: C53.1 T5.4
NetC54_1: C54.1 T5.3
NetC55_1: C55.1 T6.4
NetC56_1: C56.1 T6.3
NetC57_1: C57.1 T7.4
NetC58_1: C58.1 T7.3
NetC59_1: C59.1 T8.4
NetC60_1: C60.1 T8.3
NetD33_2: D33.2(K) R97.1
NetD34_2: D34.2(K) R98.1
NetD35_2: D35.2(K) R99.1
NetD36_2: D36.2(K) R100.1
NetD37_1: D37.1(A) D38.1(A)
NetD37_2: D37.2(K) R101.1
NetD38_2: D38.2(K) R102.1
NetD39_2: D39.2(K) R103.1
NetD40_2: D40.2(K) R104.1
NetR97_2: R97.2 T1.1
NetR98_2: R98.2 T1.2
NetR99_2: R99.2 T2.1
NetR100_2: R100.2 T2.2
NetR101_2: R101.2 T3.1
NetR102_2: R102.2 T3.2
NetR103_2: R103.2 T4.1
NetR104_2: R104.2 T4.2
NetT1_3: T1.3 T5.2
NetT1_4: T1.4 T5.1
NetT2_3: T2.3 T6.2
NetT2_4: T2.4 T6.1
NetT3_3: T3.3 T7.2
NetT3_4: T3.4 T7.1
NetT4_3: T4.3 T8.2
NetT4_4: T4.4 T8.1

### Notes on the sheet
- Labels drawn without touching a wire or pin: GND

### Library data of the parts
C53-C60 = Cap Semi: Capacitor (Semiconductor SIM Model); Manufacturer: Yageo; Manufacturer Part Number: CC1206KKX7RCBB102; Description: CAP CER 1000PF 1KV X7R 1206; Dielectric Material: Ceramic; Capacitance: 1nF; Voltage Rating (DC): 1kV; Tolerance: 10%; Dielectric: X7R; Published: 8-Jun-2000; LatestRevisionDate: 29-May-2009; LatestRevisionNote: IPC-7351 Footprint Added.; PackageReference: C1206; Publisher: Altium Limited; PackageDescription: Chip Capacitor; Supplier 1: Digi-Key; Supplier Part Number 1: 311-1144-1-ND; Stock 1: 12559; Pricing 1: 1=0.44, 10=0.304, 100=0.1821, 500=0.1366, 1000=0.1154 (USD); Mount: Surface Mount; Case/Package: 1206; Number of Pins: 2; Weight: 0.000571oz; Case Code (Imperial): 1206; Case Code (Metric): 3216; Min Operating Temperature: -55°C; Max Operating Temperature: 125°C; Packaging: Tape and Reel; Package Quantity: 1; Voltage Rating: 1kV; Termination: SMD/SMT; Composition: Ceramic; Length: 3.2mm; Height: 1.15mm; Width: 1.6mm; Thickness: 0.045inch; Depth: 1.6mm; Radiation Hardening: No; REACH SVHC: No SVHC; Lead Free: Lead Free
D33-D40 = DIODE: Default Diode; Manufacturer: NXP Semiconductors; Manufacturer Part Number: PESD5V0U1UA,115; Description: TVS DIODE 5VWM SOD3232; Direction: Unidirectional; Capacitance: 2.6pF; Number of Channels: 1; Operating Supply Voltage: 5V; Min Breakdown Voltage: 5.8V; Power Line Protection: No; Leakage Current: 100nA; Max Breakdown Voltage: 8.8V; Element Configuration: Single; Published: 8-Jun-2000; LatestRevisionDate: 17-Jul-2002; LatestRevisionNote: Re-released for DXP Platform.; PackageVersion: Sep-1996; PackageReference: SMC; Publisher: Altium Limited; PackageDescription: DO-214-AB/SMC; 2 C-Bend Leads; Body 7.9 x 5.9 mm, inc. leads (LxW); Code_JEDEC: DO-214-AB; Supplier 1: Digi-Key; Supplier Part Number 1: 1727-4155-1-ND; Stock 1: 107363; Pricing 1: 1=0.48, 10=0.36, 100=0.2243, 500=0.1535, 1000=0.1181 (USD); Mount: Surface Mount; Number of Pins: 2; Min Operating Temperature: -55°C; Max Operating Temperature: 150°C; Packaging: Tape and Reel; Package Quantity: 1; Number of Unidirectional Channels: 1; Reverse Standoff Voltage: 5V; Polarity: Unidirectional; Breakdown Voltage: 5.8V; Termination: SMD/SMT; Working Voltage: 5V; Composition: Zener; Length: 1.8mm; Depth: 1.35mm; Radiation Hardening: No; Lead Free: Lead Free
R97-R104 = Res3: Resistor; Manufacturer: Vishay; Manufacturer Part Number: CRCW120610R0FKEA; Description: RES SMD 10 OHM 1% 1/4W 1206; Resistance: 10R; Tolerance: 1%; Power Rating: 250mW; Voltage Rating: 200V; Temperature Coefficient: 100ppm/°C; Published: 8-Jun-2000; LatestRevisionDate: 29-May-2009; LatestRevisionNote: IPC-7351 Footprint Added.; PackageReference: J1-0603; Publisher: Altium Limited; PackageDescription: Chip Resistor; Supplier 1: Digi-Key; Supplier Part Number 1: 541-10.0FCT-ND; Stock 1: 0; Pricing 1: 1=0.1, 10=0.075, 100=0.0304, 1000=0.0136, 2500=0.0118 (USD); Case/Package: 1206; Number of Pins: 2; Weight: 0.000353oz; Case Code (Metric): 3216; Case Code (Imperial): 1206; Contact Plating: Lead,Tin; Min Operating Temperature: -55°C; Max Operating Temperature: 155°C; Packaging: Tape and Reel; Package Quantity: 10; Composition: Thick Film; Termination: SMD/SMT; Military Standard: Not; Voltage Rating (DC): 200V; Number of Terminations: 2; Max Power Dissipation: 250mW; Features: Automotive AEC-Q200; Length: 3.2mm; Height: 0.55mm; Width: 0.063inch; Depth: 1.6mm; Radiation Hardening: No; REACH SVHC: Unknown; Lead Free: Lead Free

## Sheet THERMO.SchDoc
size A4
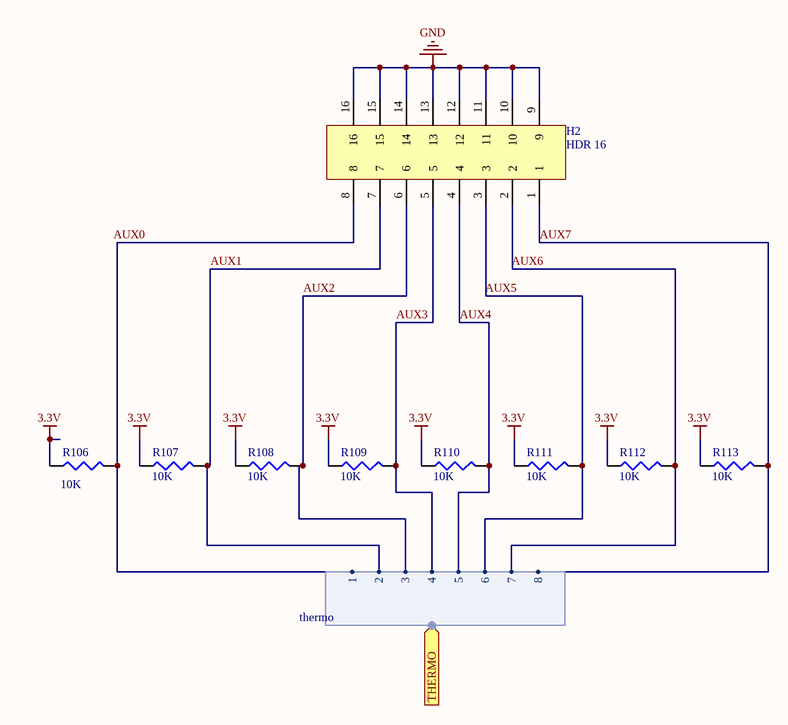
[diagram p4: THERMO.SchDoc]

### Parts
H2  HDR 16  [THERMO HDR]
R106  value 10K  [0603 RES]  (hidden comment: Res3)
R107  value 10K  [0603 RES]  (hidden comment: Res3)
R108  value 10K  [0603 RES]  (hidden comment: Res3)
R109  value 10K  [0603 RES]  (hidden comment: Res3)
R110  value 10K  [0603 RES]  (hidden comment: Res3)
R111  value 10K  [0603 RES]  (hidden comment: Res3)
R112  value 10K  [0603 RES]  (hidden comment: Res3)
R113  value 10K  [0603 RES]  (hidden comment: Res3)

### Ports
THERMO (harness thermo)

### Harnesses
thermo: 1, 2, 3, 4, 5, 6, 7, 8

### Nets
3.3V: R106.1 R107.1 R108.1 R109.1 R110.1 R111.1 R112.1 R113.1
GND: H2.9 H2.10 H2.11 H2.12 H2.13 H2.14 H2.15 H2.16
AUX1: H2.7 R107.2 ; port THERMO.2
AUX2: H2.6 R108.2 ; port THERMO.3
AUX3: H2.5 R109.2 ; port THERMO.4
AUX4: H2.4 R110.2 ; port THERMO.5
AUX7: H2.1 R113.2 ; port THERMO.8
NetH2_2: H2.2 R112.2 ; port THERMO.7
NetH2_3: H2.3 R111.2 ; port THERMO.6
NetH2_8: H2.8 R106.2 ; port THERMO.1

### Notes on the sheet
- Labels drawn without touching a wire or pin: AUX0, AUX5, AUX6

### Library data of the parts
H2 = HDR 16: Manufacturer: Molex; Manufacturer Part Number: 0430451601; Number of Positions: 16; Contact Resistance: 10mR; Max Voltage Rating (AC): 250V; Connector Type: Male Pin; Pitch: 3mm; Row Spacing: 0.118inch; Supplier 1: Digi-Key; Stock 1: 3016; Pricing 1: 1=4.7, 10=4.512, 100=3.7602, 792=2.9142, 1584=2.6321 (USD); Mount: Through Hole; Contact Plating: Gold; Contact Material: Brass; Colour: Black; Housing Material: Polymer; Housing Colour: Black; Min Operating Temperature: -40°C; Max Operating Temperature: 105°C; Packaging: Tray; Number of Rows: 2; Termination: Solder; Number of Contacts: 16; Orientation: Right Angle; Fastening Type: Ramp; Length: 28.15mm; Depth: 12.2mm; Supplier Part Number 1: WM7490-ND
R106-R113 = Res3: Resistor; Manufacturer: Vishay; Manufacturer Part Number: CRCW060310K0FKEA; Description: RES SMD 10K OHM 1% 1/10W 0603; Resistance: 10kR; Tolerance: 1%; Power Rating: 100mW; Voltage Rating: 75V; Temperature Coefficient: 100ppm/°C; Published: 8-Jun-2000; LatestRevisionDate: 29-May-2009; LatestRevisionNote: IPC-7351 Footprint Added.; PackageReference: J1-0603; Publisher: Altium Limited; PackageDescription: Chip Resistor; Supplier 1: Digi-Key; Supplier Part Number 1: 541-10.0KHCT-ND; Stock 1: 0; Pricing 1: 1=0.1, 10=0.042, 100=0.017, 1000=0.0076, 2500=0.0066 (USD); Case/Package: 0603; Number of Pins: 2; Weight: 7.1E-05oz; Case Code (Metric): 1608; Case Code (Imperial): 0603; Contact Plating: Lead,Tin; Min Operating Temperature: -55°C; Max Operating Temperature: 155°C; Packaging: Tape and Reel; Package Quantity: 10; Composition: Thick Film; Number of Terminations: 2; Military Standard: Not; Termination: SMD/SMT; Max Power Dissipation: 100mW; Voltage Rating (DC): 75V; Features: Automotive AEC-Q200; Length: 1.55mm; Height: 0.45mm; Width: 0.033inch; Depth: 0.85mm; Radiation Hardening: No; REACH SVHC: Unknown; Lead Free: Lead Free

## Nets that join several sheets
GND: BMS_rev2 (17 pins), CELL_BALANCE (5 pins), DAISY_CHAINING (6 pins), THERMO (8 pins)
TOP: BMS_rev2 (R17.1 U1.76), CELL_BALANCE (6 pins)
VSNS0: BMS_rev2 (U1.29), CELL_BALANCE (6 pins)
VSNS16: BMS_rev2 (U1.77), CELL_BALANCE (D17.1 D18.2)